# Altium schematic sheet 5V_Output_shift.SchDoc: RP2040 CNC
size B; Author: AM; CompanyName: Expatria Technologies; DrawnBy: A.Marles; Engineer: AM; Organization: Expatria Technolgoies; DocumentNumber: 4; SheetNumber: 4; SheetTotal: 4
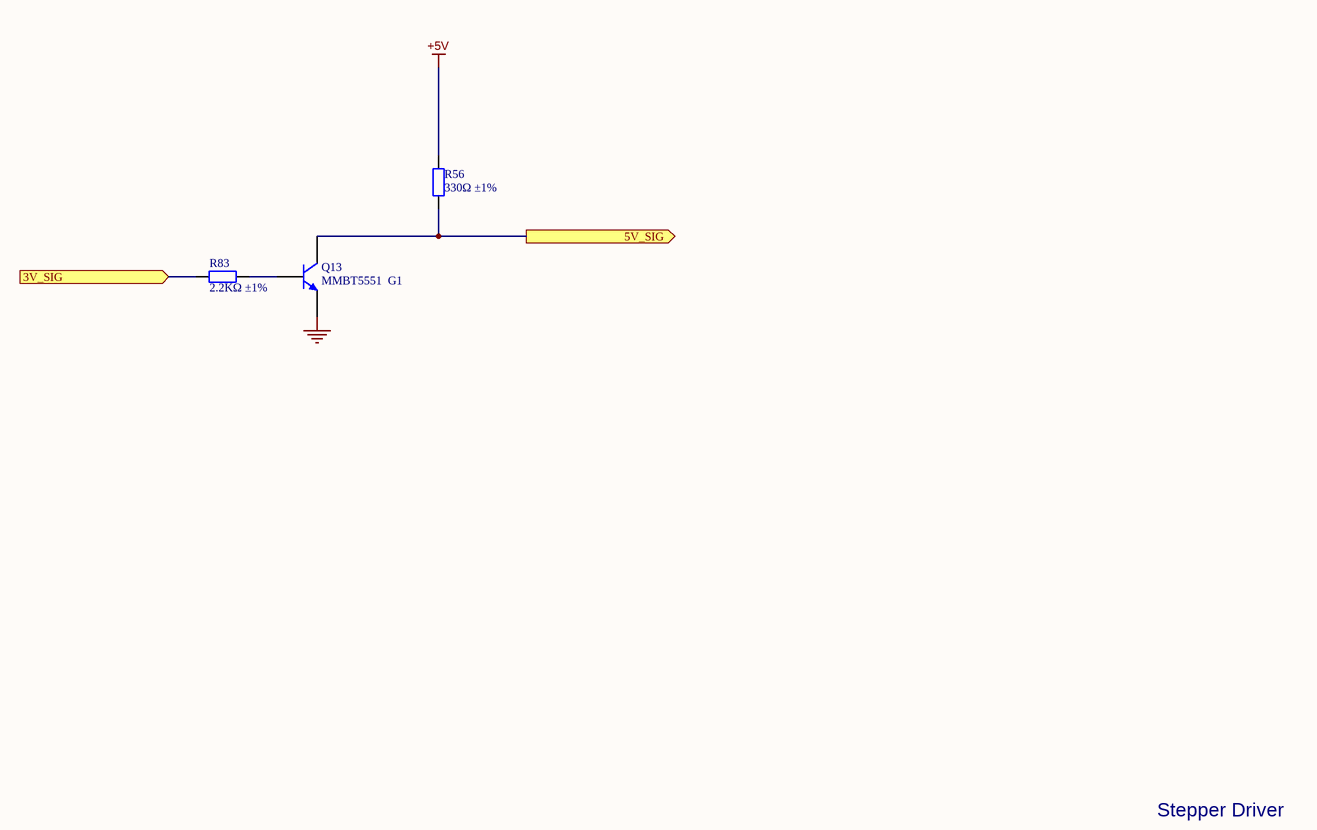
[diagram p0: 5V_Output_shift.SchDoc]

## Parts
Q13  MMBT5551  G1  [SOT-23(SOT-23-3)]
R56  330Ω ±1%  [0402_R]
R83  2.2KΩ ±1%  [0402_R]

## Ports
3V_SIG (in), 5V_SIG (out)

## Nets
+5V: R56.2
GND: Q13.2(E)
3V_SIG: R83.1 ; port 3V_SIG
5V_SIG: Q13.3(C) R56.1 ; port 5V_SIG
NetQ13_1: Q13.1(B) R83.2

## Notes on the sheet
- Stepper Driver
- SHEET
- Expatria Technologies
- 1136 Glade Court
- Port Coquitlam, BC V3B 1R5
- PROJECT
- SIZE
- ENGR
- MODIFIED
- DOCUMENT
- REV
- Copyright Expatria Technologies 2023. This document describes Open Hardware and is licensed under the CERN-OHL-S v2. No warranty is implied or expressed.
- EMAIL: INFO@EXPATRIA.CA
- B
- /

## Library data of the parts
Q13 = SOT-23 MMBT5551  G1: 三极管; ComponentLink1Description: 供应商链接; ComponentLink1URL: http://www.szlcsc.com/product/details_2502.html; Package: SOT-23; Supplier: LC; SuppliersPartNumber: C2145
R56 = 0402 330R (3300) 1%: Chip resistor; Manufacturer: Uniroyal Elec; PartNumber: 0402WGF3300TCE; Power: 1/16W; ComponentLink1Description: Supplier link; ComponentLink1URL: http://www.szlcsc.com/product/details_25847.html; Package: 0402; Supplier: LC; SuppliersPartNumber: C25104; Resistance: 330Ω; Tolerance: 1%
R83 = 0402 2.2K (2201) 1%: Chip resistor; Manufacturer: Uniroyal Elec; PartNumber: 0402WGF2201TCE; Power: 1/16W; ComponentLink1Description: Supplier link; ComponentLink1URL: http://www.szlcsc.com/product/details_26622.html; Package: 0402; Supplier: LC; SuppliersPartNumber: C25879; Resistance: 2.2KΩ; Tolerance: 1%